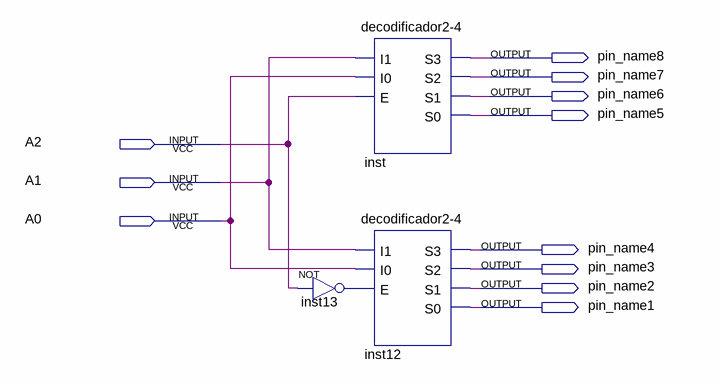
[diagram p0: schematic sheet]
// Quartus schematic decodificador3-8.bdf as structural Verilog: 3 symbols, 11 pins
module \decodificador3-8  (
  input  A2,
  input  A1,
  input  A0,
  output pin_name8,
  output pin_name7,
  output pin_name6,
  output pin_name5,
  output pin_name4,
  output pin_name3,
  output pin_name2,
  output pin_name1
);

  wire inst13_out;

  \decodificador2-4  inst (.I1(A1), .I0(A0), .E(A2), .S3(pin_name8), .S2(pin_name7), .S1(pin_name6), .S0(pin_name5));
  \decodificador2-4  inst12 (
    .I1(A1), .I0(A0), .E(inst13_out), .S3(pin_name4), .S2(pin_name3), .S1(pin_name2), .S0(pin_name1));
  not inst13 (inst13_out, A2);
endmodule
